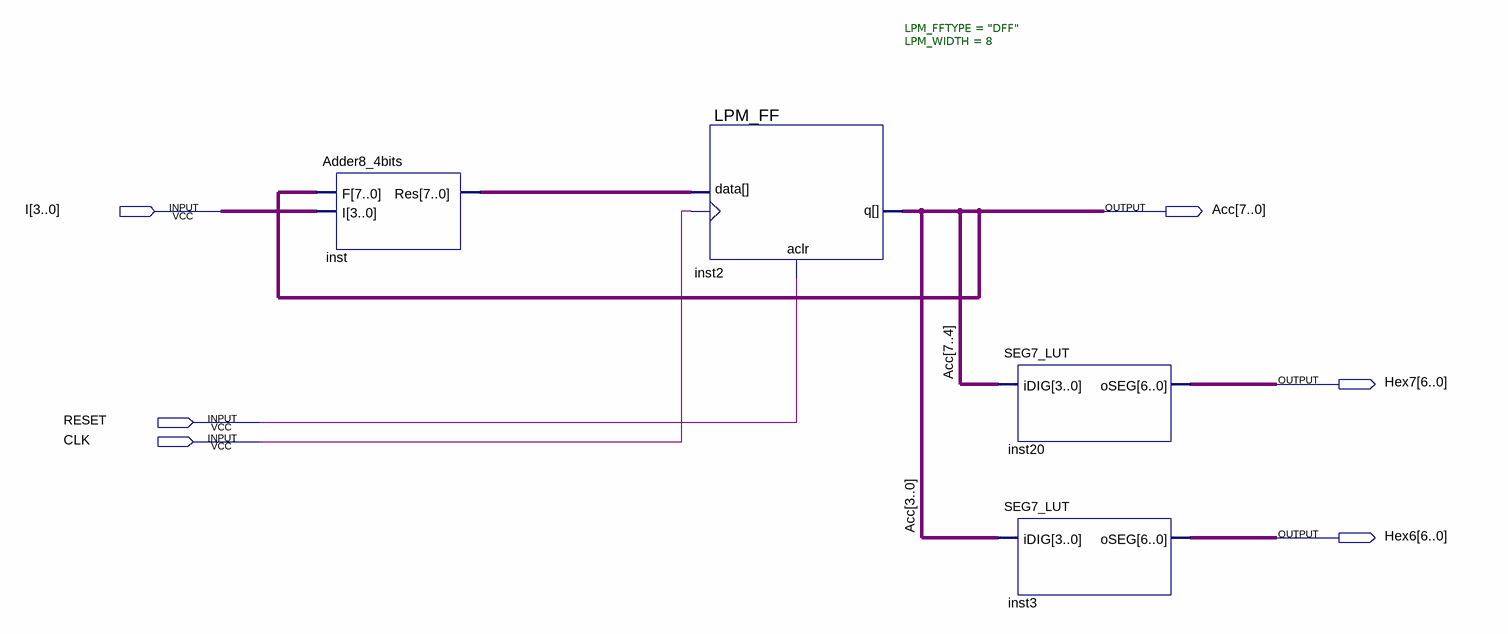
[diagram p0: schematic sheet]
// Quartus schematic Accumulator.bdf as structural Verilog: 4 symbols, 6 pins
module Accumulator (
  input  [3:0] I,
  input  RESET,
  input  CLK,
  output [7:0] Acc,
  output [6:0] Hex7,
  output [6:0] Hex6
);

  wire [7:0] inst_res;

  Adder8_4bits inst (.F(Acc), .I(I), .Res(inst_res));
  LPM_FF #(.LPM_FFTYPE("DFF"), .LPM_WIDTH(8)) inst2 (.aclr(RESET), .clock(CLK), .data(inst_res), .q(Acc));
  SEG7_LUT inst20 (.iDIG(Acc[7:4]), .oSEG(Hex7));
  SEG7_LUT inst3 (.iDIG(Acc[3:0]), .oSEG(Hex6));
endmodule
